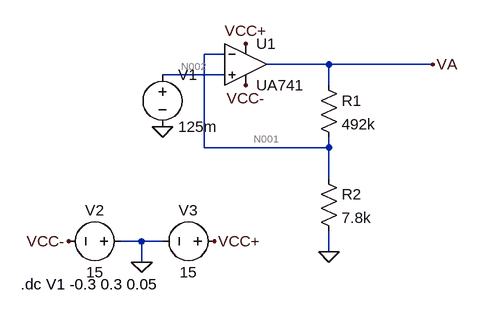
[diagram p0: schematic Draft1.asc]
* Draft1.asc
* U1: UA741 (symbol UA741\UA741 not available, pins judged from their places): In+=N002 In-=N001 V+=VCC+ V-=VCC- OUT=VA
R1 VA N001 492k
R2 N001 0 7.8k
V1 N002 0 125m
V3 VCC+ 0 15
V2 0 VCC- 15
.dc V1 -0.3 0.3 0.05
.backanno
.end

* Results of the author's LTspice run, read from the files saved beside the schematic
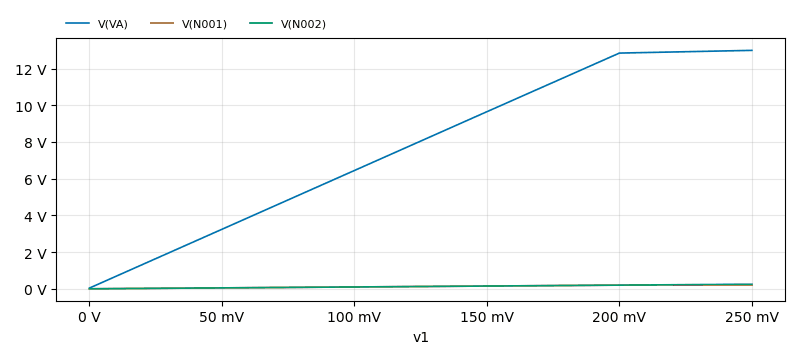
[diagram p1: DC transfer characteristic of Draft1.asc, plotted from the saved traces]
* DC transfer characteristic, 1 run:
*   V(VA): 39.95 mV at v1=0 V, 12.99 V at v1=250 mV, min 39.95 mV, max 12.99 V
*   V(N001): 11 µV at v1=0 V, 202.4 mV at v1=250 mV, min 11 µV, max 202.4 mV
*   V(N002): 0 V at v1=0 V, 250 mV at v1=250 mV, min 0 V, max 250 mV